# EAGLE design valiant_v2 (EAGLE 7.6.0)
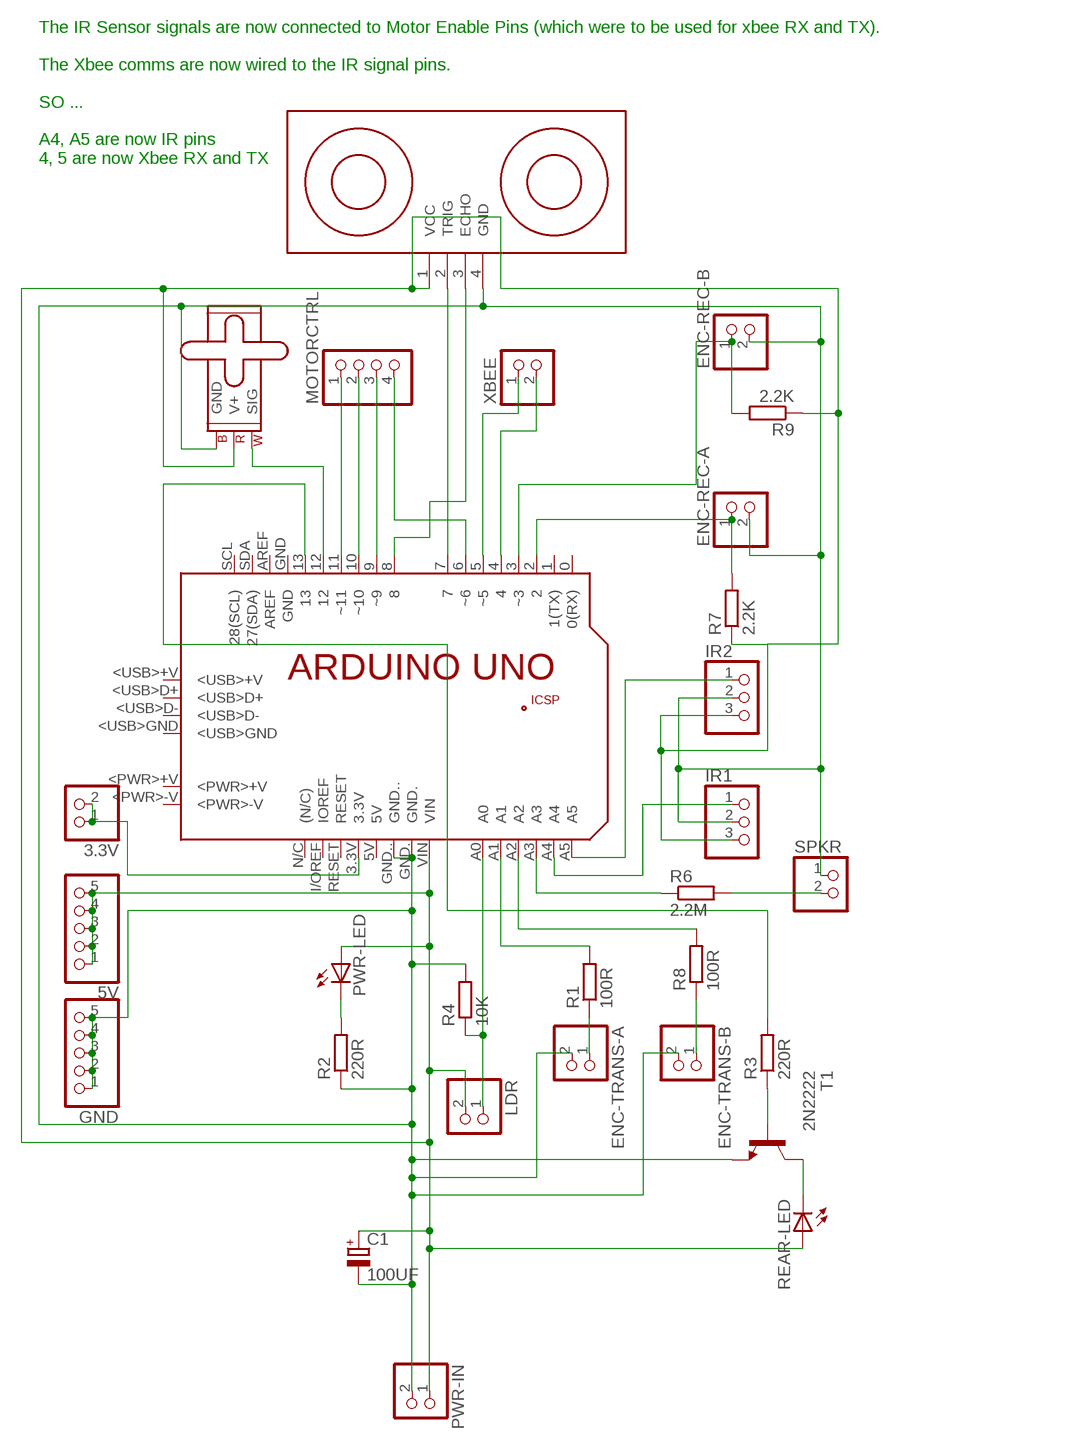
[diagram p0: schematic, sheet 1]

## Parts
3.3V  PINHD-1X2  [1X02]
5V  PINHD-1X5  [1X05]
C1  100UF  CPOL-EUE2,5-6E  [E2,5-6E]
ENC-REC-A  PINHD-1X2  [1X02]
ENC-REC-B  PINHD-1X2  [1X02]
ENC-TRANS-A  PINHD-1X2  [1X02]
ENC-TRANS-B  PINHD-1X2  [1X02]
GND  PINHD-1X5  [1X05]
IR1  PINHD-1X3  [1X03]
IR2  PINHD-1X3  [1X03]
LDR  PINHD-1X2  [1X02]
M1  SMALL_SERVO  [1X03]
MOTORCTRL  PINHD-1X4  [1X04]
PCB1  ARDUINO_UNO  [ARDUINO_UNO]
PWR-IN  PINHD-1X2  [1X02]
PWR-LED  LED5MM  [LED5MM]
R1  100R  R-EU_0204/7  [0204/7]
R2  220R  R-EU_0204/7  [0204/7]
R3  220R  R-EU_0204/7  [0204/7]
R4  10K  R-EU_0204/7  [0204/7]
R6  2.2M  R-EU_0204/7  [0204/7]
R7  2.2K  R-EU_0204/7  [0204/7]
R8  100R  R-EU_0204/7  [0204/7]
R9  2.2K  R-EU_0204/7  [0204/7]
REAR-LED  LED5MM  [LED5MM]
SPKR  PINHD-1X2  [1X02]
T1  2N2222  [TO92-EBC-OVAL]
U$1  ULTRASONIC-HC-SR04#V  [ULTRASONIC-HC-SR04#V]
XBEE  PINHD-1X2  [1X02]

## Nets
N$1: R3.1 T1.B
N$2: PCB1.7 U$1.2(TRIG)
N$3: MOTORCTRL.4 PCB1.6(~6)
N$4: MOTORCTRL.3 PCB1.9(~9)
N$5: MOTORCTRL.2 PCB1.10(~10)
N$6: MOTORCTRL.1 PCB1.11(~11)
N$7: PCB1.8 U$1.3(ECHO)
N$8: ENC-TRANS-A.1 R1.1
N$9: LDR.1 PCB1.A0 R4.1
N$10: PCB1.A1 R1.2
N$11: PCB1.A2 R8.2
N$12: PCB1.13 R3.2
N$13: ENC-REC-A.1 PCB1.2 R7.2
N$14: 3.3V.1 3.3V.2 PCB1.3.3V
N$15: 5V.1 5V.2 5V.3 5V.4 5V.5 C1.+ IR1.3 IR2.3 LDR.2 M1.2(V+) PCB1.VIN PWR-IN.1 PWR-LED.A R7.1 R9.1 REAR-LED.A U$1.1(VCC)
N$16: ENC-TRANS-B.1 R8.1
N$17: PWR-LED.K(C) R2.2
N$18: M1.1(SIG) PCB1.12
N$19: REAR-LED.K(C) T1.C
N$20: IR1.1 PCB1.A4
N$21: PCB1.5(~5) XBEE.1
N$22: PCB1.4 XBEE.2
N$23: ENC-REC-B.1 PCB1.3(~3) R9.2
N$24: R6.2 SPKR.2
N$25: PCB1.A3 R6.1
N$26: C1.- ENC-REC-A.2 ENC-REC-B.2 ENC-TRANS-A.2 ENC-TRANS-B.2 GND.1 GND.2 GND.3 GND.4 GND.5 IR1.2 IR2.2 M1.3(GND) PCB1.GND. PCB1.GND.. PWR-IN.2 R2.1 R4.2 SPKR.1 T1.E U$1.4(GND)
N$27: IR2.1 PCB1.A5
Unconnected: PCB1.0(0(RX)) PCB1.1(1(TX)) PCB1.5V PCB1.+5V PCB1.<PWR>+V PCB1.<PWR>-V PCB1.<USB>+V PCB1.<USB>D+ PCB1.<USB>D- PCB1.<USB>GND PCB1.AREF PCB1.GND PCB1.GND_ PCB1.I/OREF(IOREF) PCB1.MISO PCB1.MOSI PCB1.N/C((N/C)) PCB1.RESET PCB1.RESET. PCB1.SCK PCB1.SCL(28(SCL)) PCB1.SDA(27(SDA))

## Notes on the sheet
- The IR Sensor signals are now connected to Motor Enable Pins (which were to be used for xbee RX and TX).
  
  The Xbee comms are now wired to the IR signal pins.
  
  SO ...
  
  A4, A5 are now IR pins
  4, 5 are now Xbee RX and TX

## Library data of the parts
3.3V ENC-REC-A ENC-REC-B ENC-TRANS-A ENC-TRANS-B LDR PWR-IN SPKR XBEE = pinhead:PINHD-1X2: PIN HEADER
5V GND = pinhead:PINHD-1X5: PIN HEADER
C1 = resistor:CPOL-EU: POLARIZED CAPACITOR, European symbol
IR1 IR2 = pinhead:PINHD-1X3: PIN HEADER
M1 = SparkFun-Electromechanical:SMALL_SERVO: Small servo motor This is the small servo used in the SIK. SKU: ROB-09065
MOTORCTRL = pinhead:PINHD-1X4: PIN HEADER
PCB1 = E14_Arduino_revB:ARDUINO_UNO: Device for representing an Arduino Uno board with a footprint in an EAGLE design. Created by Dave Young for Element14. More EAGLE documentation at: http://www.element14.com/community/community/knode/cadsoft_eagle
PWR-LED REAR-LED = adafruit:LED: LED OSRAM: - CHIPLED LG R971, LG N971, LY N971, LG Q971, LY Q971, LO R971, LY R971 LH N974, LH R974 LS Q976, LO Q976, LY Q976 LO Q996 - Hyper CHIPLED LW Q18S LB Q993, LB Q99A, LB R99A - SideLED LS A670, LO A670, LY A670, LG A670, LP A670 LB A673, LV A673, LT A673, LW A673 LH A674 LY A675 LS A676, LA A676, LO A676, LY A676, LW A676 LS A679, LY A679, LG A679 - Hyper Micro SIDELED® LS Y876, LA Y876, LO Y876, LY Y876 LT Y87S - SmartLED LW L88C, LW L88S LB L89C, LB L89S, LG L890 LS L89K, LO L89K, LY L89K LS L896, LA L896, LO L896, LY L896 - TOPLED LS T670, LO T670, LY T670, LG T670, LP T670 LSG T670, LSP T670, LSY T670, LOP T670, LYG T670 LG T671, LOG T671, LSG T671 LB T673, LV T673, LT T673, LW T673 LH T674 LS T676, LA T676, LO T676, LY T676, LB T676, LH T676, LSB T676, LW T676 LB T67C, LV T67C, LT T67C, LS T67K, LO T67K, LY T67K, LW E67C LS E67B, LA E67B, LO E67B, LY E67B, LB E67C, LV E67C, LT E67C LW T67C LS T679, LY T679, LG T679 LS T770, LO T770, LY T770, LG T770, LP T770 LB T773, LV T773, LT T773, LW T773 LH T774 LS E675, LA E675, LY E675, LS T675 LS T776, LA T776, LO T776, LY T776, LB T776 LHGB T686 LT T68C, LB T68C - Hyper Mini TOPLED® LB M676 - Mini TOPLED Santana® LG M470 LS M47K, LO M47K, LY M47K Source: http://www.osram.convergy.de/
R1-R4 R6-R9 = rcl:R-EU_: RESISTOR, European symbol
T1 = adafruit:2N2222: NPN TRANSISTOR Big oval pads
U$1 = diy-modules:ULTRASONIC-HC-SR04: Ultrasonic Ranging Module HC-SR04

## Board
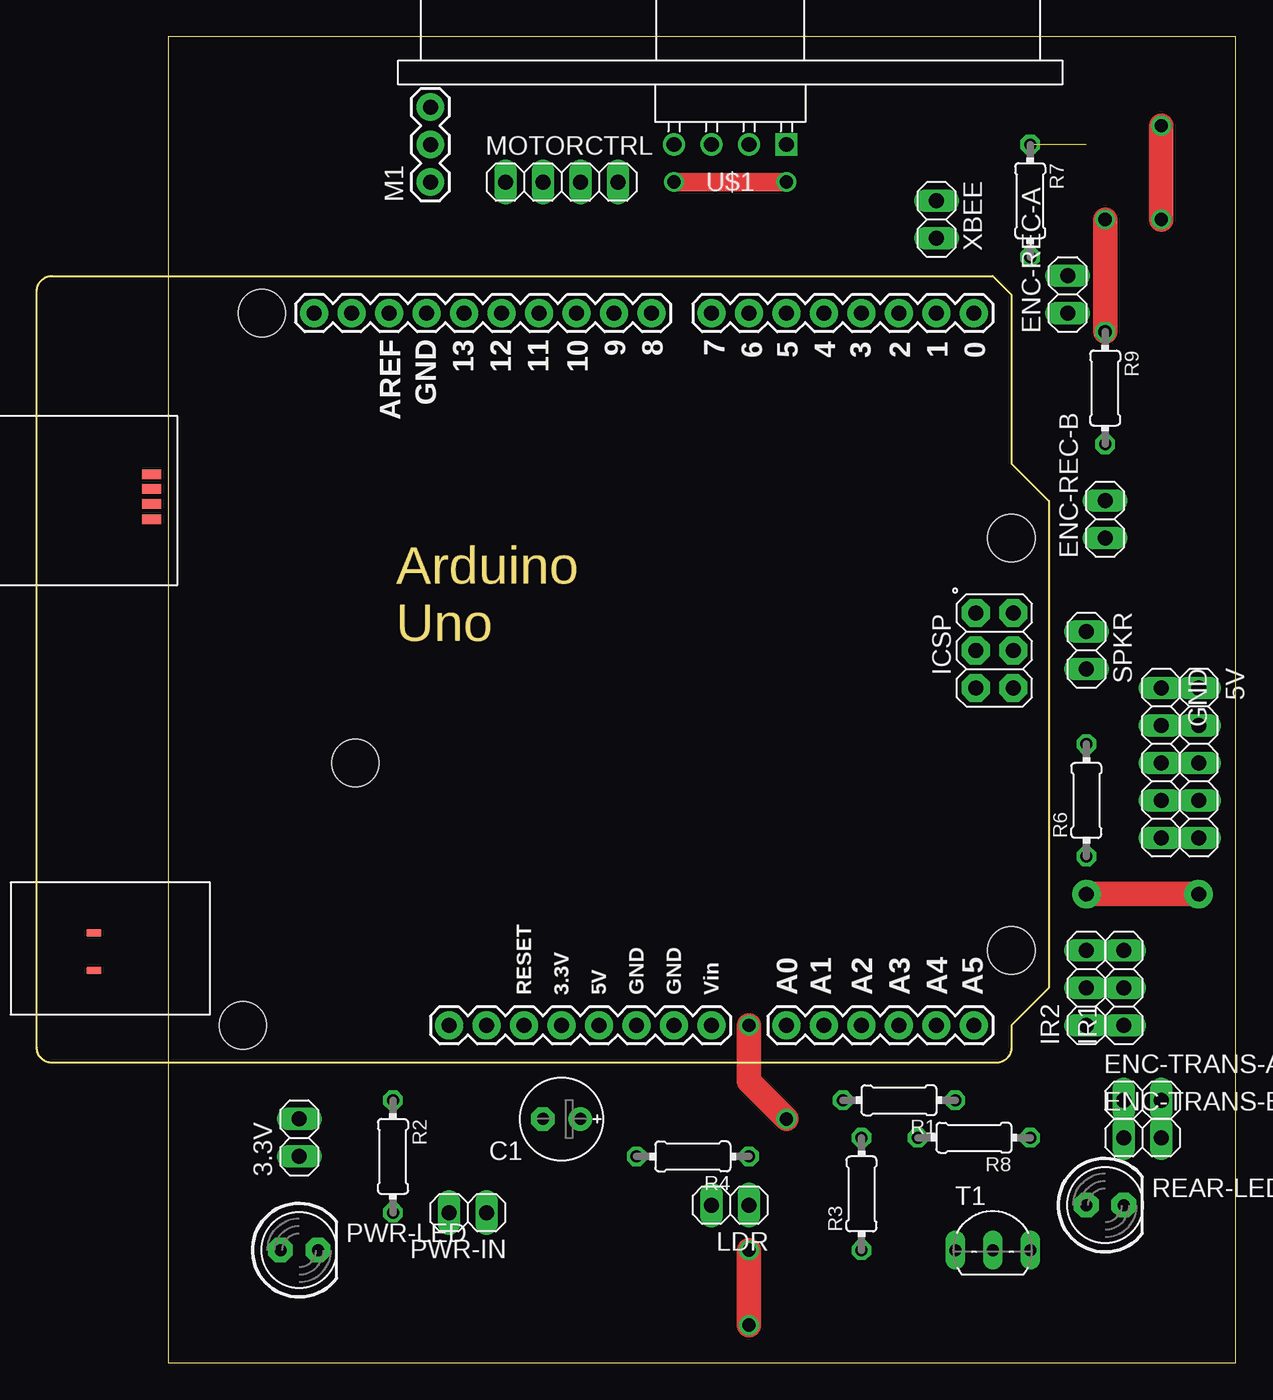
[diagram p1: board, top side]
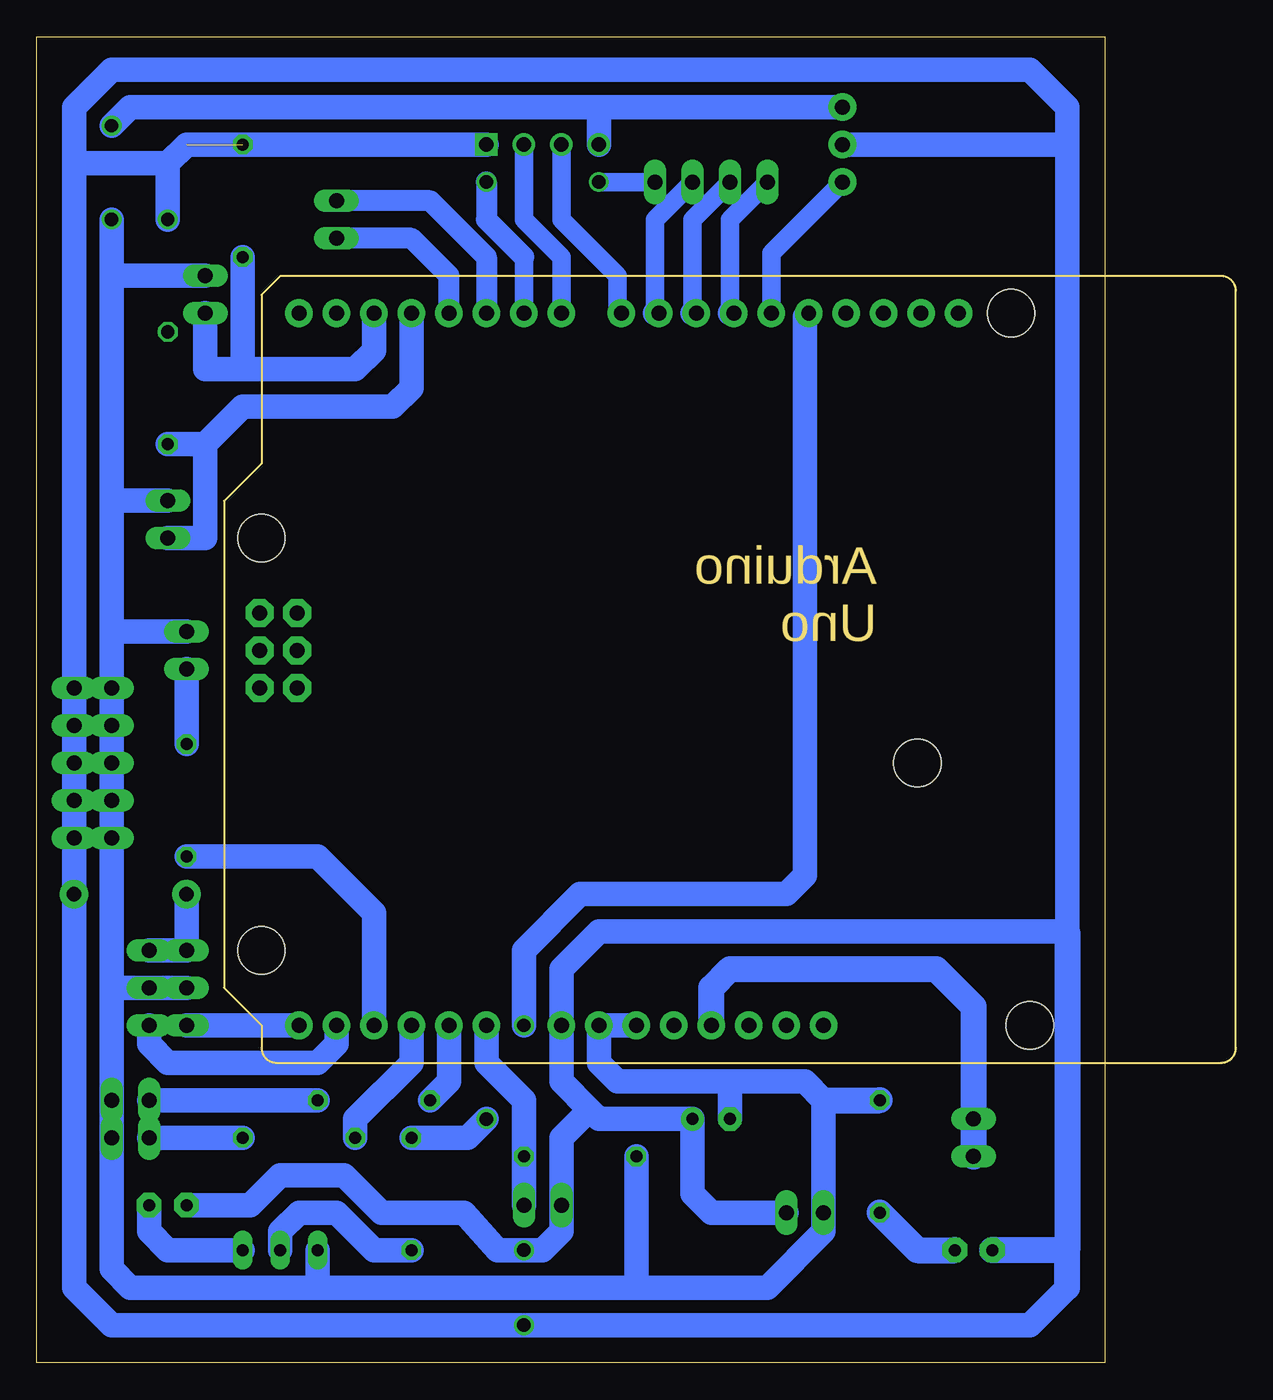
[diagram p2: board, bottom side, seen from below]

Size 72.37 x 89.84 mm. Coordinates in mm from the lower left corner, seen from the top.
Outline: 0,0 72.37,0 72.37,89.84 0,89.84 0,0
Copper layers (1*16): Top 0.035mm / dielectric 1.5mm / Bottom 0.035mm
Design rules "default *": minimum track width 10mil, minimum drill 24mil, track to track 8mil, track to pad 8mil, pad to pad 8mil, via to via 8mil, smd to smd 8mil, copper to edge 40mil, drill to drill 8mil, minimum pad ring 10mil, minimum via ring 8mil, stop-mask expansion 4mil, vias tented up to drill 0mil, thermal gap 10mil
Holes 3.2 mm at 12.7,40.64

### Footprints (pad centres in the part's own frame; a part is rotated, then mirrored left to right if it is on the bottom)
1X02 = drill 1.016 long: 1 -1.27,0; 2 1.27,0
1X05 = drill 1.016 long: 1 -5.08,0; 2 -2.54,0; 3 0,0; 4 2.54,0; 5 5.08,0
E2,5-6E = drill 0.813 pad 1.575: + -1.27,0 | drill 0.813 pad 1.575 octagon: - 1.27,0
1X03 = drill 1.016 long: 1 -2.54,0; 2 0,0; 3 2.54,0
1X03' = drill 1.016 pad 1.88: 1 0,0; 2 2.54,0; 3 5.08,0
1X04 = drill 1.016 long: 1 -3.81,0; 2 -1.27,0; 3 1.27,0; 4 3.81,0
ARDUINO_UNO = drill 1.016 pad 1.88: 0 63.5,50.8; 1 60.96,50.8; 2 58.42,50.8; 3 55.88,50.8; 3.3V 35.56,2.54; 4 53.34,50.8; 5 50.8,50.8; 5V 38.1,2.54; 6 48.26,50.8; 7 45.72,50.8; 8 41.656,50.8; 9 39.116,50.8; 10 36.576,50.8; 11 34.036,50.8; 12 31.496,50.8; 13 28.956,50.8; A0 50.8,2.54; A1 53.34,2.54; A2 55.88,2.54; A3 58.42,2.54; A4 60.96,2.54; A5 63.5,2.54; AREF 23.876,50.8; GND 26.416,50.8; GND. 43.18,2.54; GND.. 40.64,2.54; I/OREF 30.48,2.54; N/C 27.94,2.54; RESET 33.02,2.54; SCL 18.796,50.8; SDA 21.336,50.8; VIN 45.72,2.54 | drill 1.016 pad 1.88 octagon: +5V 66.167,30.48; GND_ 66.167,25.4; MISO 63.627,30.48; MOSI 66.167,27.94; RESET. 63.627,25.4; SCK 63.627,27.94 | smd 1.016 x 0.508: <PWR>+V 3.861,8.814; <PWR>-V 3.861,6.274 | smd 1.27 x 0.635: <USB>+V 7.772,39.878; <USB>D+ 7.772,38.887; <USB>D- 7.772,37.871; <USB>GND 7.772,36.83 | hole 3.2: 66.04,7.62; 66.04,35.56; 15.24,50.8; 13.97,2.54
LED5MM = drill 0.813 pad 1.676 octagon: A -1.27,0; K 1.27,0
0204/7 = drill 0.813 octagon: 1 -3.81,0; 2 3.81,0
TO92-EBC-OVAL = drill 0.813 long: B 0,-1.27; C 2.54,-1.27; E -2.54,-1.27
ULTRASONIC-HC-SR04#V = drill 1 square: 1 -3.81,0 | drill 1: 2 -1.27,0; 3 1.27,0; 4 3.81,0

### Placement (x,y rotation side)
3.3V  8.89,15.24 90 top
5V  69.85,40.64 270 top
C1  26.67,16.51 180 top
ENC-REC-A  60.96,72.39 90 top
ENC-REC-B  63.5,57.15 90 top
ENC-TRANS-A  66.04,17.78 0 top
ENC-TRANS-B  66.04,15.24 0 top
GND  67.31,40.64 270 top
IR1  64.77,25.4 90 top
IR2  62.23,25.4 90 top
LDR  38.1,10.67 180 top
M1  SMALL_SERVO  [1X03']  17.78,80.01 90 top
MOTORCTRL  26.67,80.01 0 top
PCB1  -8.89,20.32 0 top
PWR-IN  20.32,10.16 180 top
PWR-LED  8.89,7.62 0 top
R1  49.53,17.78 180 top
R2  15.24,13.97 270 top
R3  46.99,11.43 90 top
R4  35.56,13.97 180 top
R6  62.23,38.1 90 top
R7  58.42,78.74 270 top
R8  54.61,15.24 180 top
R9  63.5,66.04 270 top
REAR-LED  63.5,10.67 0 top
SPKR  62.23,48.26 270 top
T1  55.88,8.89 0 top
U$1  38.1,82.55 180 top
XBEE  52.07,77.47 270 top

### Tracks (layer width: path | path; a pad name or v marks a point on that pad's centre or on a via)
N$1
  Bottom 1.676: T1.B 55.88,8.89 54.61,10.16 52.07,10.16 49.53,7.62 R3.1
N$2
  Bottom 1.27: U$1.2 39.37,77.47 36.83,74.93 PCB1.7
N$3  (via drill 0.9)
  Top 1.27: v34.29,80.01 v41.91,80.01
  Bottom 1.27: MOTORCTRL.4 v34.29,80.01 | 39.37,74.93 PCB1.6
  Bottom 1.422: v41.91,80.01 41.91,77.47 39.37,74.93
N$4
  Bottom 1.27: 30.48,71.12 30.48,77.47 MOTORCTRL.3
  Bottom 1.676: 30.48,71.12 PCB1.9
N$5
  Bottom 1.27: 27.94,71.12 27.94,77.47 MOTORCTRL.2
  Bottom 1.676: 27.94,71.12 PCB1.10
N$6
  Bottom 1.27: 25.4,71.12 25.4,77.47 MOTORCTRL.1
  Bottom 1.676: 25.4,71.12 PCB1.11
N$7
  Bottom 1.27: U$1.3 36.83,77.47 33.02,73.66 33.02,71.37 PCB1.8
N$8
  Bottom 1.676: R1.1 ENC-TRANS-A.1
N$9
  Bottom 1.676: LDR.1 R4.1 39.37,17.78 41.91,20.32 PCB1.A0
N$10
  Bottom 1.676: R1.2 44.45,19.05 PCB1.A1
N$11
  Bottom 1.676: R8.2 50.8,16.51 46.99,20.32 PCB1.A2
N$12  (via drill 0.9)
  Top 1.676: v41.91,16.51 39.37,19.05 v39.37,22.86
  Bottom 1.676: R3.2 43.18,15.24 v41.91,16.51 | v39.37,22.86 39.37,27.94 35.56,31.75 21.59,31.75 20.32,33.02 20.32,70.87 PCB1.13
N$13
  Bottom 1.676: PCB1.2 49.53,68.58 50.8,67.31 58.42,67.31 | R7.2 58.42,72.39 58.42,67.31 | ENC-REC-A.1 60.96,67.31 58.42,67.31
N$14
  Bottom 1.778: PCB1.3.3V 26.67,25.4 25.4,26.67 11.43,26.67 8.89,24.13 3.3V.2 3.3V.1
N$15  (via drill 0.9, 1 pad 1.93)  (1 unrouted)
  Top 1.676: R9.1 v63.5,77.47 | v39.37,7.62 v39.37,2.54 | v62.23,31.75 v69.85,31.75
  Bottom 1.676: 2.54,5.08 5.08,2.54 v39.37,2.54 67.31,2.54 69.85,5.08 v69.85,31.75 5V.5 5V.4 5V.3 5V.2 5V.1 69.85,81.28 | v63.5,77.47 63.5,81.28 | 34.92,17.14 36.83,19.05 PCB1.VIN 36.83,26.67 34.29,29.21 2.54,29.21 2.54,82.55 | 34.92,17.14 34.29,16.51 C1.+ 27.94,11.43 26.67,10.16 PWR-IN.1 | 34.92,17.14 36.83,15.24 LDR.2 36.83,8.89 38.1,7.62 v39.37,7.62 41.15,7.62 43.43,10.16 49.02,10.16 51.56,12.7 55.88,12.7 57.91,10.67 REAR-LED.A | 63.5,81.28 69.85,81.28 | 2.54,82.55 2.54,85.09 5.08,87.63 67.31,87.63 69.85,85.09 69.85,81.28 | M1.2 2.54,82.55 | 63.5,81.28 62.23,82.55 U$1.1 | IR1.3 IR2.3 v62.23,31.75
  Bottom 1.778: 2.54,29.21 2.54,7.62 | 2.54,5.08 2.54,7.62 | 2.54,7.62 PWR-LED.A
  other vias: 63.5,69.85
N$16
  Bottom 1.676: ENC-TRANS-B.1 R8.1
N$17
  Bottom 1.778: R2.2 12.7,7.62 PWR-LED.K
N$18
  Bottom 1.27: PCB1.12 22.61,75.18 M1.1
N$19
  Bottom 1.676: T1.C 63.5,7.62 64.77,8.89 REAR-LED.K
N$20
  Bottom 1.676: PCB1.A4 52.07,21.59 53.34,20.32 63.5,20.32 64.77,21.59 IR1.1
N$21
  Bottom 1.422: PCB1.5 41.91,74.93 45.72,78.74 XBEE.1
N$22
  Bottom 1.422: PCB1.4 44.45,73.66 46.99,76.2 XBEE.2
N$23
  Bottom 1.676: PCB1.3 46.99,66.04 48.26,64.77 58.42,64.77 60.96,62.23 | ENC-REC-B.1 60.96,55.88 60.96,62.23 | R9.2 60.96,62.23
N$24
  Bottom 1.676: SPKR.2 R6.2
N$25
  Bottom 1.676: R6.1 53.34,34.29 49.53,30.48 PCB1.A3
N$26  (via drill 0.9)
  Top 1.676: v67.31,77.47 v67.31,83.82
  Bottom 1.676: 34.29,85.09 U$1.4 | 67.31,25.4 GND.5 GND.4 GND.3 GND.2 GND.1 67.31,49.53 | 67.31,25.4 ENC-TRANS-A.2 ENC-TRANS-B.2 67.31,6.35 66.04,5.08 53.34,5.08 | 67.31,73.66 v67.31,77.47 | 31.75,5.08 22.86,5.08 19.05,8.89 PWR-IN.2 19.05,17.78 20.32,19.05 25.4,19.05 | 31.75,5.08 53.34,5.08 | 25.4,19.05 33.02,19.05 34.29,20.32 PCB1.GND. PCB1.GND.. | 34.29,85.09 M1.3 | ENC-REC-A.2 67.31,73.66 | R4.2 31.75,5.08 | C1.- 25.4,19.05 | v67.31,83.82 66.04,85.09 34.29,85.09 | T1.E 53.34,5.08 | ENC-REC-B.2 67.31,58.42 | 67.31,58.42 67.31,49.53 | 67.31,58.42 67.31,73.66 | IR2.2 IR1.2 67.31,25.4 | SPKR.1 67.31,49.53
  Bottom 1.778: 19.05,17.78 R2.1
N$27
  Bottom 1.676: PCB1.A5 IR2.1